# Altium project Serializer_Board.PrjPcb (part 1 of 2)
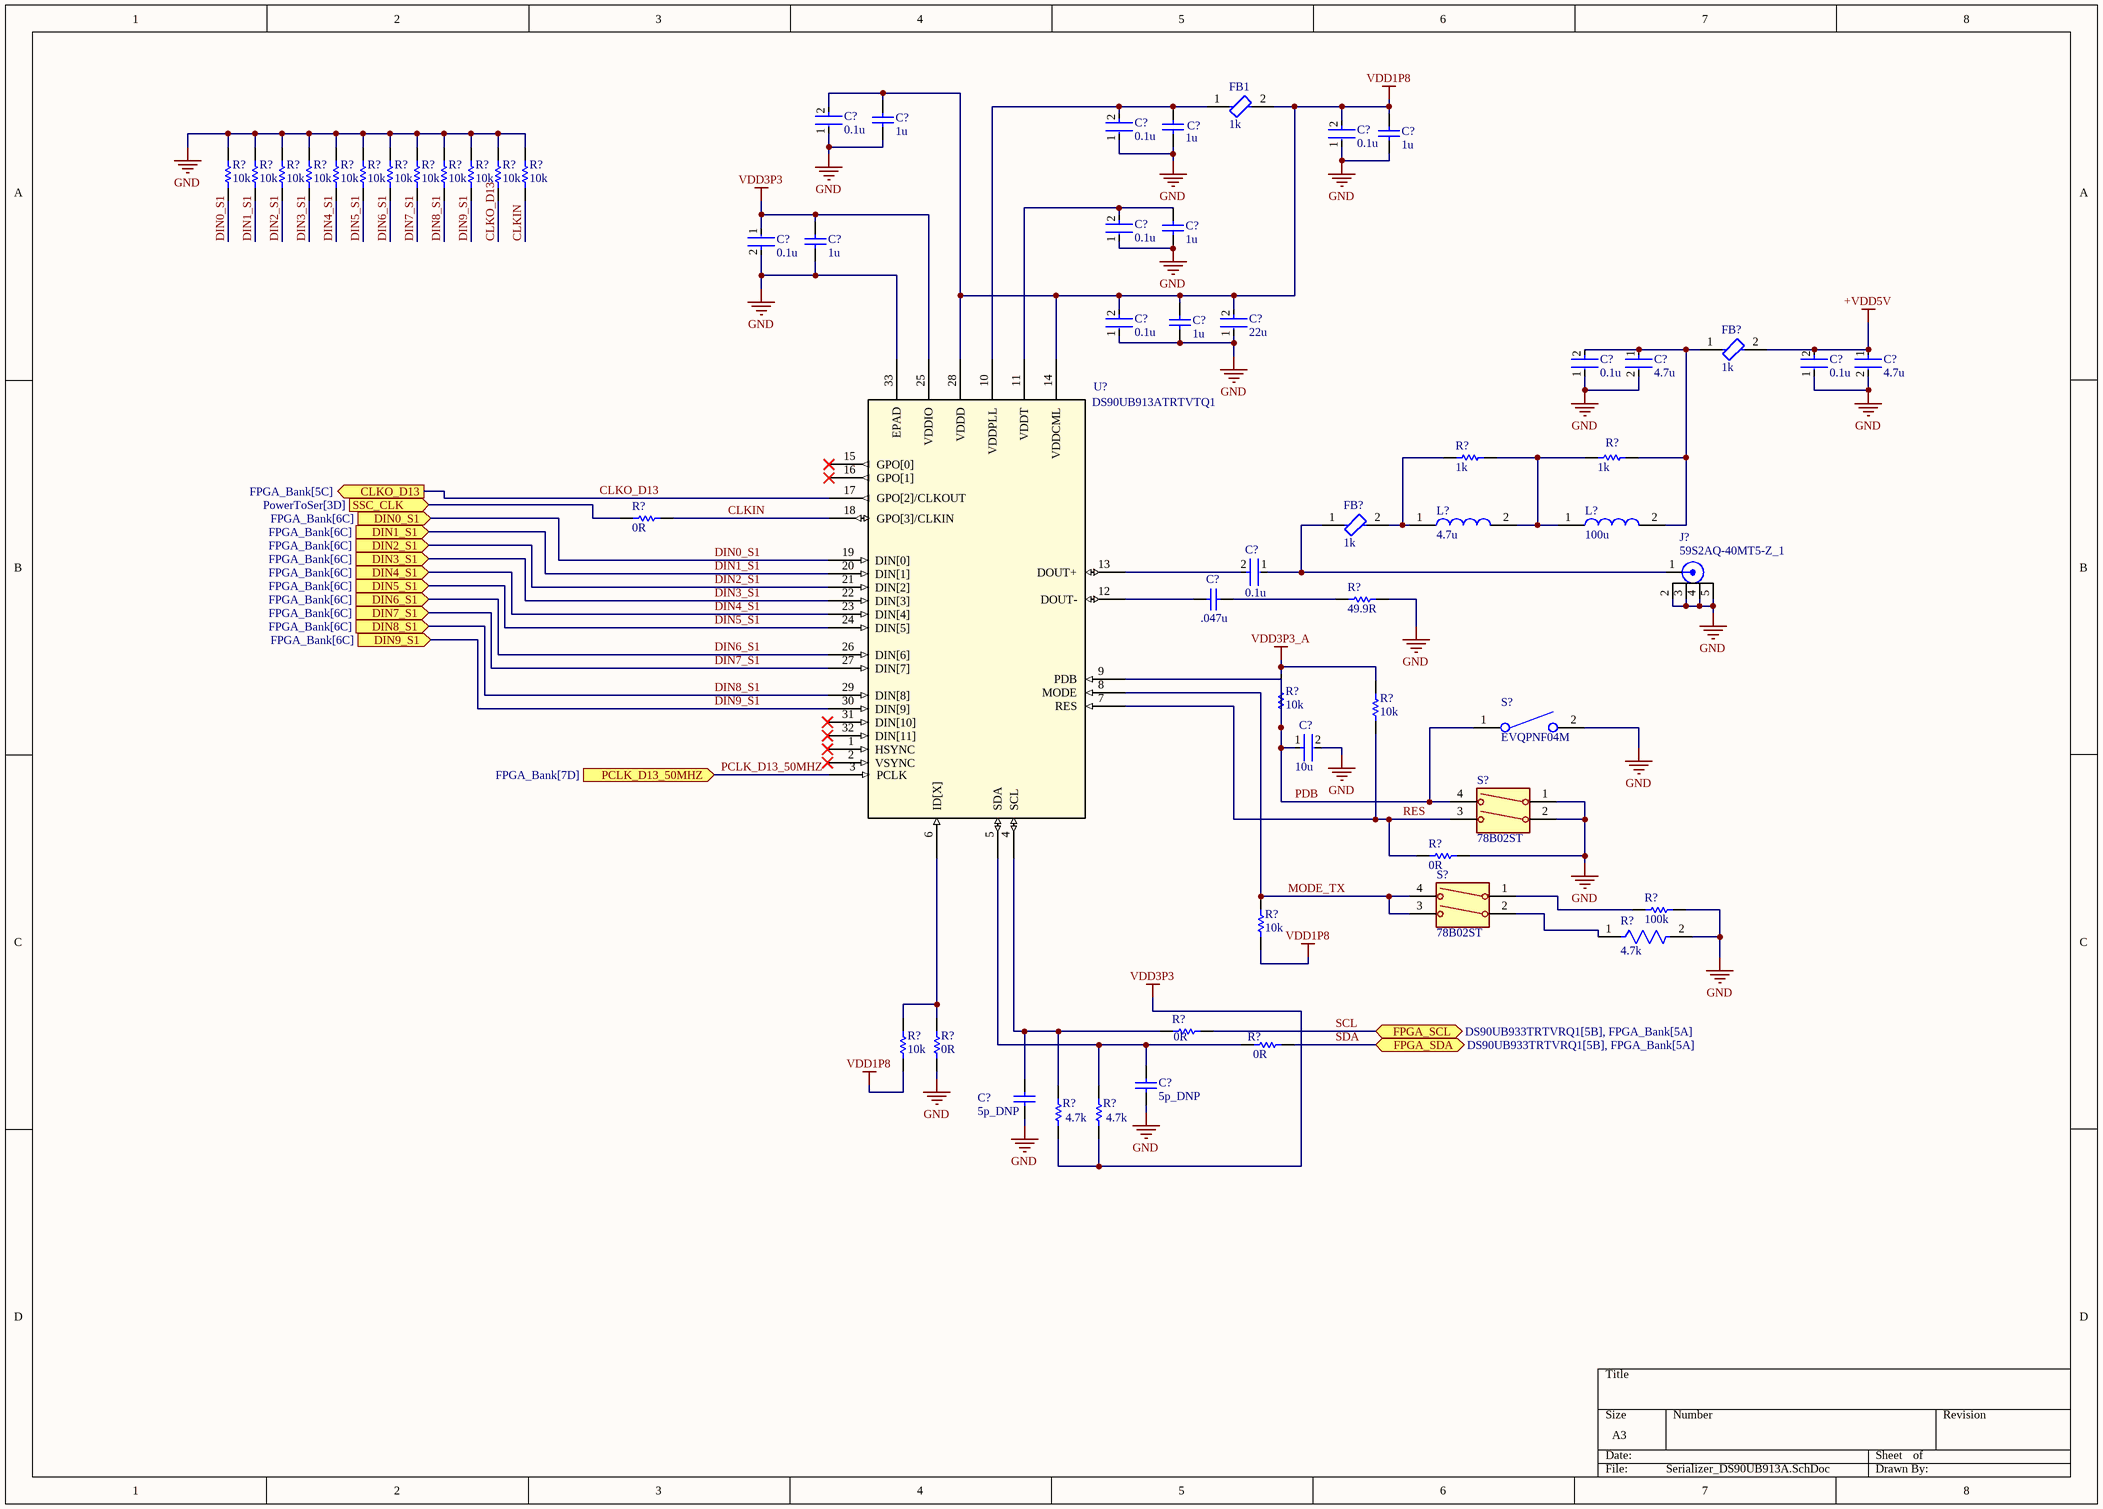
[diagram p0: Serializer_DS90UB913A.SchDoc]
5 sheets, 223 parts. Net scope: flat (ports and power ports of the same name join across sheets).
Sheets:
  Serializer_DS90UB913A.SchDoc
  BuckRegulatorOnSer.SchDoc
  DS90UB933TRTVRQ1.SchDoc
  FTDI_USB_To_UART.SchDoc
  FPGA_Bank.SchDoc

## Sheet Serializer_DS90UB913A.SchDoc
size A3; SheetNumber: 2; SheetTotal: 7

### Parts
(Parts that share a designator on the sheet are numbered #1, #2 ... from top to bottom, then left to right.)
C?#1  0.1u  [FP-GRM15-MFG]
C?#2  0.1u  [FP-GRM15-MFG]
C?#3  0.1u  [FP-GRM15-MFG]
C?#4  1u  [CAPC1608X90X35ML10T15]
C?#5  1u  [CAPC1608X90X35ML10T15]
C?#6  1u  [CAPC1608X90X35ML10T15]
C?#7  0.1u  [FP-GRM15-MFG]
C?#8  1u  [CAPC1608X90X35ML10T15]
C?#9  1u  [CAPC1608X90X35ML10T15]
C?#10  0.1u  [FP-GRM15-MFG]
C?#11  0.1u  [FP-GRM15-MFG]
C?#12  22u  [FP-GCM32E-0_3-IPC_B]
C?#13  1u  [CAPC1608X90X35ML10T15]
C?#14  0.1u  [FP-GRM15-MFG]
C?#15  4.7u  [FP-GRM21B-0_15-MFG]
C?#16  0.1u  [FP-GRM15-MFG]
C?#17  4.7u  [FP-GRM21B-0_15-MFG]
C?#18  0.1u  [FP-GRM15-MFG]
C?#19  .047u  [CAPC1608X90X35ML10T15]
C?#20  10u  [FP-GRM21B-0_1-IPC_C]
C?#21  5p_DNP  [CAPC1005X55X25LL05T10]
C?#22  5p_DNP  [CAPC1005X55X25LL05T10]
FB1  1k  [FP-BLM18-0_15-t0_8-MFG]
FB?#1  1k  [FP-BLM18-0_15-t0_8-MFG]
FB?#2  1k  [FP-BLM18-0_15-t0_8-MFG]
J?#1  59S2AQ-40MT5-Z_1  [ROSENBERGER_59S2AQ-40MT5-Z_1]
L?#1  4.7u  [1008PS]
L?#2  100u  [MSS7341T104MLB]
R?#1  10k  [RESC1005X40X25ML05T05]
R?#2  10k  [RESC1005X40X25ML05T05]
R?#3  10k  [RESC1005X40X25ML05T05]
R?#4  10k  [RESC1005X40X25ML05T05]
R?#5  10k  [RESC1005X40X25ML05T05]
R?#6  10k  [RESC1005X40X25ML05T05]
R?#7  10k  [RESC1005X40X25ML05T05]
R?#8  10k  [RESC1005X40X25ML05T05]
R?#9  10k  [RESC1005X40X25ML05T05]
R?#10  10k  [RESC1005X40X25ML05T05]
R?#11  10k  [RESC1005X40X25ML05T05]
R?#12  10k  [RESC1005X40X25ML05T05]
R?#13  1k  [RESC1608X55X30LL15T15]
R?#14  1k  [RESC1608X55X30LL15T15]
R?#15  0R  [RESC1005X40X25LL05T05]
R?#16  49.9R  [RESC1608X55X30ML15T15]
R?#17  10k  [RESC1005X40X25ML05T05]
R?#18  10k  [RESC1005X40X25ML05T05]
R?#19  0R  [RESC1005X40X25LL05T05]
R?#20  100k  [RESC2013X70X40ML20T20]
R?#21  10k  [RESC1005X40X25ML05T05]
R?#22  4.7k  [FP-ERJ6GE-MFG]
R?#23  0R  [RESC1005X40X25LL05T05]
R?#24  0R  [RESC1005X40X25LL05T05]
R?#25  10k  [RESC1005X40X25ML05T05]
R?#26  0R  [RESC1005X40X25LL05T05]
R?#27  4.7k  [RESC1005X40X25LL05T05]
R?#28  4.7k  [RESC1005X40X25LL05T05]
S?#1  EVQPNF04M  [EVQ5PN05K]
S?#2  78B02ST  [78B02ST]
S?#3  78B02ST  [78B02ST]
U?#1  DS90UB913ATRTVTQ1  [RTV32_3P1X3P1_TEX]

### Ports
CLKO_D13 (out, see FPGA_Bank[5C]), DIN0_S1 (in, see FPGA_Bank[6C]), DIN1_S1 (in, see FPGA_Bank[6C]), DIN2_S1 (in, see FPGA_Bank[6C]), DIN3_S1 (in, see FPGA_Bank[6C]), DIN4_S1 (in, see FPGA_Bank[6C]), DIN5_S1 (in, see FPGA_Bank[6C]), DIN6_S1 (in, see FPGA_Bank[6C]), DIN7_S1 (in, see FPGA_Bank[6C]), DIN8_S1 (in, see FPGA_Bank[6C]), DIN9_S1 (in, see FPGA_Bank[6C]), FPGA_SCL (bidir, see DS90UB933TRTVRQ1[5B], FPGA_Bank[5A]), FPGA_SDA (bidir, see DS90UB933TRTVRQ1[5B], FPGA_Bank[5A]), PCLK_D13_50MHZ (in, see FPGA_Bank[7D]), SSC_CLK (in, see PowerToSer[3D])

### Nets
+VDD5V: C?#16.2 C?#17.1 FB?#1.2
GND: C?#1.1 C?#2.1 C?#3.1 C?#4.1 C?#5.1 C?#6.1 C?#7.1 C?#8.1 C?#9.1 C?#10.2 C?#11.1 C?#12.1 C?#13.1 C?#14.1 C?#15.2 C?#16.1 C?#17.2 C?#20.2 C?#21.1 C?#22.1 J?#1.2 J?#1.3 J?#1.4 J?#1.5 R?#1.2 R?#2.2 R?#3.2 R?#4.2 R?#5.2 R?#6.2 R?#7.2 R?#8.2 R?#9.2 R?#10.2 R?#11.2 R?#12.2 R?#16.2 R?#19.1 R?#20.2 R?#22.2 R?#26.1 S?#1.2(NO) S?#2.1(COM_1) S?#2.2(NO_1) U?#1.33(EPAD)
VDD1P8: C?#1.2 C?#3.2 C?#4.2 C?#6.2 C?#11.2 C?#12.2 C?#13.2 FB1.2 R?#21.1 R?#25.1 U?#1.14(VDDCML) U?#1.28(VDDD)
VDD3P3: C?#9.2 C?#10.1 R?#27.1 R?#28.1 U?#1.25(VDDIO)
VDD3P3_A: R?#17.2 R?#18.2
CLKIN: R?#12.1 R?#15.1 U?#1.18(GPO[3]/CLKIN)  [project net CLKIN_2]
CLKO_D13: R?#11.1 U?#1.17(GPO[2]/CLKOUT) ; port CLKO_D13
DIN0_S1: R?#1.1 U?#1.19(DIN[0]) ; port DIN0_S1
DIN1_S1: R?#2.1 U?#1.20(DIN[1]) ; port DIN1_S1
DIN2_S1: R?#3.1 U?#1.21(DIN[2]) ; port DIN2_S1
DIN3_S1: R?#4.1 U?#1.22(DIN[3]) ; port DIN3_S1
DIN4_S1: R?#5.1 U?#1.23(DIN[4]) ; port DIN4_S1
DIN5_S1: R?#6.1 U?#1.24(DIN[5]) ; port DIN5_S1
DIN6_S1: R?#7.1 U?#1.26(DIN[6]) ; port DIN6_S1
DIN7_S1: R?#8.1 U?#1.27(DIN[7]) ; port DIN7_S1
DIN8_S1: R?#9.1 U?#1.29(DIN[8]) ; port DIN8_S1
DIN9_S1: R?#10.1 U?#1.30(DIN[9]) ; port DIN9_S1
MODE_TX: R?#21.2 S?#3.3(COM_2) S?#3.4(NO_2) U?#1.8(MODE)  [project net MODE_TX_2]
PCLK_D13_50MHZ: U?#1.3(PCLK) ; port PCLK_D13_50MHZ
PDB: C?#20.1 R?#17.1 S?#1.1(COM) S?#2.4(NO_2) U?#1.9(PDB)  [project net PDB_2]
RES: R?#18.1 R?#19.2 S?#2.3(COM_2) U?#1.7(RES)  [project net RES_2]
SCL: R?#23.1 ; port FPGA_SCL
SDA: R?#24.1 ; port FPGA_SDA
NetC?#2_2: C?#2.2 C?#5.2 FB1.1 U?#1.10(VDDPLL)
NetC?#7_2: C?#7.2 C?#8.2 U?#1.11(VDDT)
NetC?#14_2: C?#14.2 C?#15.1 FB?#1.1 L?#2.2 R?#14.2
NetC?#18_1: C?#18.1 FB?#2.1 J?#1.1
NetC?#18_2: C?#18.2 U?#1.13(DOUT+)
NetC?#19_1: C?#19.1 U?#1.12(DOUT-)
NetC?#19_2: C?#19.2 R?#16.1
NetC?#21_2: C?#21.2 R?#24.2 R?#28.2 U?#1.5(SDA)
NetC?#22_2: C?#22.2 R?#23.2 R?#27.2 U?#1.4(SCL)
NetFB?#2_2: FB?#2.2 L?#1.1 R?#13.1
NetL?#1_2: L?#1.2 L?#2.1 R?#13.2 R?#14.1
NetR?#15_2: R?#15.2 ; port SSC_CLK
NetR?#20_1: R?#20.1 S?#3.1(COM_1)
NetR?#22_1: R?#22.1 S?#3.2(NO_1)
NetR?#25_2: R?#25.2 R?#26.2 U?#1.6(ID[X])

Not connected (* = marked no-connect by the designer): U?#1 1(HSYNC)* 2(VSYNC)* 15(GPO[0])* 16(GPO[1])* 31(DIN[10])* 32(DIN[11])*

### Library data of the parts
C?#1-C?#3 C?#7 C?#10 C?#11 C?#14 C?#16 C?#18 = CMP-2100-03641-2: CAP CER 0.1UF 16V X7R 0402; Manufacturer Part Number: GRM155R71C104KA88D; Manufacturer: Murata; Standoff Height: 0mm; Tolerance: 10%; Voltage Rating: 16Vdc; Material: Ceramic; Capacitance: 0.10μF; Value: 0.10μF; RoHS: TRUE; Temperature Characteristic: X7R; Octopart: https://octopart.com/grm155r71c104ka88d-murata-196880; Digikey Description: CAP CER 0.1UF 16V X7R 0402; Device Class L3: Ceramic Capacitors; Height: 0.55mm; ComponentLink2Description: Datasheet; Temperature Range Low: -55°C; Ipc Land Pattern Name: CAPC10050X219; ComponentLink2URL: https://search.murata.co.jp/Ceramy/image/img/A01X/G101/ENG/GRM155R71H471KA01-01A.pdf; Device Class L1: Passive Components; Lead Free: yes; Category: Cap; Package: GRM15; Temperature: -55°C to +125°C; Device Class L2: Capacitors; Temperature Range High: +125°C; Mouser Description: 0402 0.1 uF 16V ±10 % Tolerance X7R SMT Multilayer Ceramic Capacitor
C?#4-C?#6 C?#8 C?#9 C?#13 = CMP-2006-02460-1: Manufacturer: Murata; Part Number: GRM188R71E105KA12D
C?#12 = CMP-06035-049658-1: Ceramic Capacitor for Automotive 22uF ±10% 16VDC X7R 1210 Embossed T/R; Voltage Rating: 16V; Max Operating Temperature: 125°C; Case/Package: 1210; Packaging: Tape and Reel; Termination: SMD/SMT; Height: 2.5mm; Voltage Rating (DC): 16V; Length: 3.2mm; Width: 0.098inch; Voltage: 16V; Depth: 2.5mm; Package Quantity: 1; Mount: Surface Mount; Min Operating Temperature: -55°C; Case Code (Metric): 3225; Case Code (Imperial): 1210; Radiation Hardening: No; Thickness: 0.106inch; Ratings: AEC-Q200; Capacitance: 22uF; Tolerance: 10%; Dielectric: X7R; Lead Free: Lead Free
C?#15 C?#17 = CMP-2007-03401-2: CAP CER 4.7UF 16V X7R 0805; Material: Ceramic; Tolerance: 10%; Case Code (Metric): 2012; Voltage Rating: 16V; RoHS Compliant: Yes; Voltage Rating (DC): 16V; Case/Package: 0805; Number of Pins: 2; Thickness: 0.053inch; Voltage: 16V; Mount: Surface Mount; Packaging: Tape and Reel; Lead Free: Lead Free; Case Code (Imperial): 0805; Series: GRM; Width: 0.049inch; Package Quantity: 1; Construction: Flat; Min Operating Temperature: -55°C; Termination: SMD/SMT; Max Operating Temperature: 125°C; Length: 2mm; Dielectric: X7R; Depth: 1.25mm; REACH SVHC: No SVHC; Height: 1.25mm; Capacitance: 4.7uF
C?#19 = CMP-2006-02927-1: Manufacturer: Murata; Part Number: GRM188R71H473KA61D
C?#20 = CMP-2007-03453-2: Chip Multilayer Ceramic Capacitors for General Purpose, 0805, 10uF, X5R, 15%, 10%, 16V; Radiation Hardening: No; Thickness: 0.053inch; Voltage Rating (DC): 16V; Lead Free: Lead Free; Package Quantity: 1; Width: 1.25mm; Case Code (Imperial): 0805; Depth: 1.25mm; Packaging: Tape and Reel; Dielectric: X5R; Max Operating Temperature: 85°C; Tolerance: 10%; Voltage Rating: 16V; Voltage: 16V; Capacitance: 10uF; Height: 1.25mm; Case Code (Metric): 2012; Material: Ceramic; Mount: Surface Mount; Case/Package: 0805; REACH SVHC: No SVHC; Length: 2mm; Min Operating Temperature: -55°C; Termination: SMD/SMT
C?#21 C?#22 = CMP-2008-04391-1: Manufacturer: Murata; Part Number: GRM1555C1H5R0CA01D
FB1 FB?#1 FB?#2 = CMP-0686-00457-3: Chip Ferrite Bead, 0603, 1000Ω @ 100MHz, 0.5Ω, 25%, 450mABLM18AG102SN1D; Number of Circuits: 1; Max DC Current: 400mA; Shielding: Unshielded; DC Resistance (DCR): 500mR; Material: Steel; DC Resistance-Max: 700mR; Impedance: 1kR; Case Code (Imperial): 0603; Max Current Rating: 400mA; Frequency: 100MHz; Min Operating Temperature: -55°C; Case/Package: 0603; Depth: 0.8mm; Lead Free: Lead Free; Core Material: Ferrite; Current Rating: 400mA; Resistance: 500mR; Case Code (Metric): 1608; DC Current: 400mA; Package Quantity: 1; Packaging: Tape and Reel; Width: 0.8mm; Military Standard: Not; Height: 0.8mm; Series: BLM18A; Max Operating Temperature: 125°C; Tolerance: 25%; Termination: SMD/SMT; Test Frequency: 100MHz; Number of Lines: 1; Number of Pins: 2; REACH SVHC: No SVHC; Length: 1.6mm; Radiation Hardening: No
J?#1 = 59S2AQ-40MT5-Z_1: RF Connectors / Coaxial Connectors Plug PC-Board SMD Right AngleZWatrBlue; Package: None; Price: None; Value: *; MP: 59S2AQ-40MT5-Z_1; Availability: Unavailable
L?#1 = 1008PS-472KLB: Inductor; Manufacturer_Name: COILCRAFT; Datasheet Link: https://www.coilcraft.com/pdfs/1008ps.pdf; Manufacturer_Part_Number: 1008PS-472KLB; Mouser Part Number: 994-1008PS-472KLB; Mouser Price/Stock: https://www.mouser.co.uk/ProductDetail/Coilcraft/1008PS-472KLB?qs=zCSbvcPd3pZjtFGTYwqcAw%3D%3D
L?#2 = MSS7341T-104MLB: Inductor; Manufacturer_Name: COILCRAFT; Manufacturer_Part_Number: MSS7341T-104MLD; Datasheet Link: https://componentsearchengine.com/Datasheets/2/MSS7341T-104MLD.pdf; Height: 4.1mm; Mouser Part Number: 994-MSS7341T-104MLD; Mouser Price/Stock: https://www.mouser.co.uk/ProductDetail/Coilcraft/MSS7341T-104MLD?qs=zCSbvcPd3paCy6uSM7W%2FOg%3D%3D
R?#1-R?#12 R?#17 R?#18 R?#21 R?#25 = CMP-2002-00433-1: Part Number: ERJ-2GEJ103X; Manufacturer: Panasonic
R?#13 R?#14 = CMP-2000-00180-1: Part Number: ERJ-3EKF1001V; Manufacturer: Panasonic
R?#15 R?#19 R?#23 R?#24 R?#26 = CMP-2000-07451-1: Chip Resistor, 0 Ohm, 0.1 W, -55 to 155 degC, 0402 (1005 Metric), RoHS, Tape and Reel; Manufacturer: Panasonic; Voltage Rating (DC): 50V; Temperature Coefficient: 600ppm/��C; Max Power Dissipation: 100mW; Resistance: 0mOhm; Tolerance: 5%; Number of Terminations: 2; Mount: SurfaceMount; Height: 0.35mm; Packaging: TapeandReel; Contact Plating: Tin; Manufacturer URL: http://www.panasonic.com/; Composition: ThickFilm; Max Operating Temperature: 155degC; REACH SVHC: NoSVHC; Case/Package: 0402; Package Reference: 402; Depth: 0.5mm; Package Description: 2-Pin Surface Mount Device, Body 1 x 0.5 mm; Datasheet URL: https://industrial.panasonic.com/cdbs/www-data/pdf/RDA0000/AOA0000C301.pdf; RoHSCompliant: True; Case Code (Imperial): 0402; Military Standard: Not; Min Operating Temperature: -55degC; Power Rating: 100mW; Datasheet Version: 03/2015; Length: 1mm; Case Code (Metric): 1005; Termination: SMD/SMT; Mounting Technology: SurfaceMount; Voltage Rating: 50V; Width: 0.02inch; Package Quantity: 1; Lead Free: LeadFree; Radiation Hardening: No
R?#16 = CMP-2000-00538-1: Manufacturer: Panasonic; Part Number: ERJ-3EKF49R9V
R?#20 = CMP-2001-04377-1: Part Number: ERJ-6ENF1003V; Manufacturer: Panasonic
R?#22 = CMP-2001-00420-2: RES SMD 4.7K OHM 5% 1/8W 0805; Power Rating: 125mW; Voltage Rating (DC): 150V; Temperature Coefficient: 200ppm/°C; Resistance: 4.7kR; Lead Free: Lead Free; Length: 2mm; Resistance Tolerance: 5%; Tolerance: 5%; Mount: Surface Mount; Number of Terminations: 2; Technology: THICK FILM; Case Code (Metric): 2012; Resistor Type: Thick Film; Max Power Dissipation: 125mW; Series: ERJ; Radiation Hardening: No; Min Operating Temperature: -55°C; RoHS Compliant: Yes; Case/Package: 0805; Package Quantity: 5000; Size Code: 0805; Width: 0.049inch; Voltage Rating: 150V; Contact Plating: Tin; Military Standard: Not; Height: 0.6mm; Construction: Rectangular; Packaging: Tape and Reel; Max Operating Temperature: 155°C; Termination: SMD/SMT; REACH SVHC: No SVHC; Case Code (Imperial): 0805; Depth: 1.25mm
R?#27 R?#28 = CMP-2002-01154-4: Chip Resistor, 4.7 KOhm, +/- 1%, 0.1 W, -55 to 155 degC, 0402 (1005 Metric), RoHS, Tape and Reel; PartNumber: ERJ-2RKF4701X; Voltage Rating: 50 V; Case\/Package: 0402; Power Rating: 100 mW; Height: 0.35 mm; Mounting Technology: Surface Mount; REACH SVHC: Yes; Resistance: 4.7 KOhm; Max Operating Temperature: 155 degC; ComponentLink1Description: Manufacturer URL; ComponentLink2Description: Datasheet; Pins: 2; PackageReference: 0402; Tolerance: 1%; Case Code (Imperial): 0402; Length: 1 mm; PackageDescription: 2-Pin Surface Mount Device, Body 1 x 0.5 mm; RoHSCompliant: true; Package Quantity: 1; Radiation Hardening: No; DatasheetVersion: 04/2015; Width: 0.5 mm; Case Code (Metric): 1005; Mount: Surface Mount; ComponentLink1URL: http://www.panasonic.com/; Min Operating Temperature: -55 degC; Packaging: Cut Tape; ComponentLink2URL: http://industrial.panasonic.com/cdbs/www-data/pdf/RDA0000/AOA0000C86.pdf
S?#1 = EVQPNF04M: Switch; Manufacturer_Name: Panasonic; Datasheet Link: https://industrial.panasonic.com/cdbs/www-data/pdf/ATK0000/ATK0000C376.pdf; Manufacturer_Part_Number: EVQPNF04M
S?#2 S?#3 = 78B02ST: PCB Slide Switch Single Pole Single Throw (SPST) 150 mA Slide; Manufacturer_Name: Grayhill; Geometry.Height: 7.49mm; Mouser Part Number: 706-78B02ST; Mouser Price/Stock: https://www.mouser.co.uk/ProductDetail/Grayhill/78B02ST?qs=ls7QRyWmRk63wsT9ZvgLUg%3D%3D; Manufacturer_Part_Number: 78B02ST; Datasheet Link: https://datasheet.datasheetarchive.com/originals/distributors/SFDatasheet-7/sf-000148477.pdf
U?#1 = DS90UB913ATRTVTQ1: 25- to 100-MHz, 10-bit & 12-bit FPD-Link III serializer 32-WQFN -40 to 105; Manufacturer_Name: Texas Instruments; Copyright: Copyright (C) 2025 Ultra Librarian. All rights reserved.; Manufacturer_Part_Number: DS90UB913ATRTVTQ1; RefDes: RefDes; Type: Type

## Sheet BuckRegulatorOnSer.SchDoc
size 381 x 241 mm; SheetNumber: 3; SheetTotal: 7
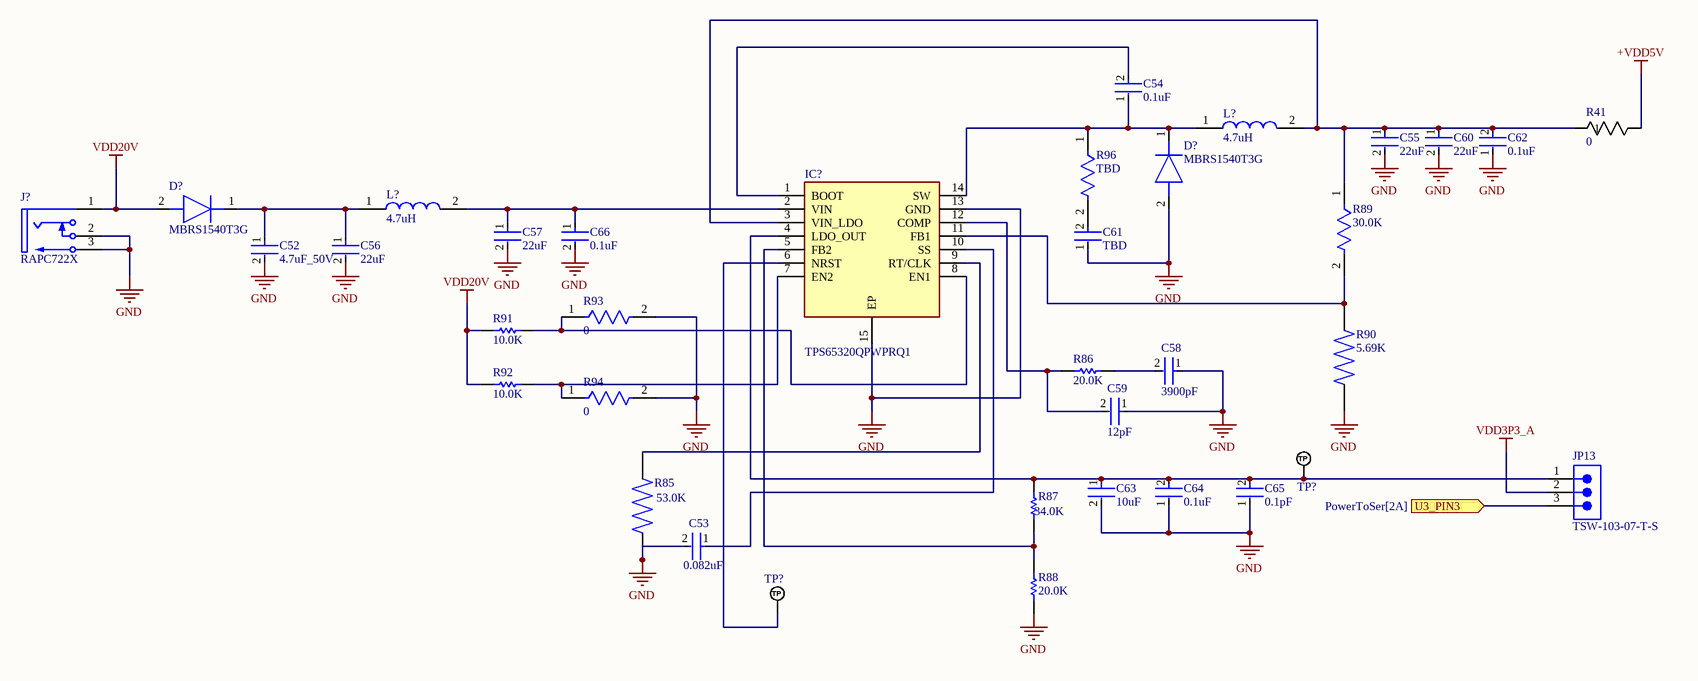
[diagram p1: BuckRegulatorOnSer.SchDoc]

### Parts
(Parts that share a designator on the sheet are numbered #1, #2 ... from top to bottom, then left to right.)
C52  4.7uF_50V  [FP-C3216-160-0_2-IPC_B]
C53  0.082uF  [FP-C0402-BB-MFG]
C54  0.1uF  [FP-GRM15-MFG]
C55  22uF  [FP-C3216-160-0_2-IPC_B]
C56  22uF  [FP-C3216-160-0_2-IPC_B]
C57  22uF  [FP-C3216-160-0_2-IPC_B]
C58  3900pF  [FP-C0402-BB-MFG]
C59  12pF  [FP-C0402-BB-MFG]
C60  22uF  [FP-C3216-160-0_2-IPC_B]
C61  TBD  [FP-GRM15-MFG]
C62  0.1uF  [FP-GRM15-MFG]
C63  10uF  [FP-C2012-125-0_2-MFG]
C64  0.1uF  [FP-GRM15-MFG]
C65  0.1pF  [FP-GRM15-MFG]
C66  0.1uF  [FP-GRM188-0_1-e0_2_0_5-IPC_B]
D?#1  MBRS1540T3G  [DIOM5436X256N]
D?#2  MBRS1540T3G  [DIOM5436X256N]
IC?#1  TPS65320QPWPRQ1  [SOP65P640X120-15N]
J?#2  RAPC722X  [SWITCH-RAPC712X-3_V]
JP13  TSW-103-07-T-S  [SMTC-TSW-103-07-X-S]
L?#3  4.7uH  [XFL4020472MEB]
L?#4  4.7uH  [XFL4020472MEB]
R41  0  [RC2512N_VIS]
R85  53.0K  [RESC1608X46N]
R86  20.0K  [RESC1608X55X30ML15T15]
R87  34.0K  [RESC1608X55X30ML15T15]
R88  20.0K  [RESC1608X55X30ML15T15]
R89  30.0K  [FP-ERJ3EK-IPC_A]
R90  5.69K  [RESC1608X46N]
R91  10.0K  [RESC1609X55X30LL15T15]
R92  10.0K  [RESC1609X55X30LL15T15]
R93  0  [FP-ERJ-3GEY0R00V-MFG]
R94  0  [FP-ERJ-3GEY0R00V-MFG]
R96  TBD  [FP-CRCW0603-e3-MFG]
TP?#1  TP_NOBOM  [PAD_RND_1MM]  (value not drawn)  (no BOM)
TP?#2  TP_NOBOM  [PAD_RND_1MM]  (value not drawn)  (no BOM)

### Ports
U3_PIN3 (in, see PowerToSer[2A])

### Nets
+VDD5V: R41.2
GND: C52.2 C53.2 C55.2 C56.2 C57.2 C58.1 C59.1 C60.2 C61.1 C62.1 C63.2 C64.1 C65.1 C66.2 D?#1.2(A) IC?#1.13(GND) IC?#1.15(EP) J?#2.2 J?#2.3 R85.2 R88.2 R90.2 R93.2 R94.2
VDD3P3_A: JP13.2
VDD20V: D?#2.2(A) J?#2.1 R91.1 R92.1
NetC52_1: C52.1 C56.1 D?#2.1(K) L?#4.1
NetC53_1: C53.1 IC?#1.10(SS)
NetC54_1: C54.1 D?#1.1(K) IC?#1.14(SW) L?#3.1 R96.1
NetC54_2: C54.2 IC?#1.1(BOOT)
NetC55_1: C55.1 C60.1 C62.2 IC?#1.3(VIN_LDO) L?#3.2 R41.1 R89.1
NetC57_1: C57.1 C66.1 IC?#1.2(VIN) L?#4.2
NetC58_2: C58.2 R86.2
NetC59_2: C59.2 IC?#1.12(COMP) R86.1
NetC61_2: C61.2 R96.2
NetC63_1: C63.1 C64.2 C65.2 IC?#1.4(LDO_OUT) JP13.1 R87.1 TP?#1.1(TP)
NetIC?#1_5: IC?#1.5(FB2) R87.2 R88.1
NetIC?#1_6: IC?#1.6(NRST) TP?#2.1(TP)
NetIC?#1_7: IC?#1.7(EN2) R92.2 R94.1
NetIC?#1_8: IC?#1.8(EN1) R91.2 R93.1
NetIC?#1_9: IC?#1.9(RT/CLK) R85.1
NetIC?#1_11: IC?#1.11(FB1) R89.2 R90.1
NetJP13_3: JP13.3 ; port U3_PIN3

### Library data of the parts
C52 = CMP-08246-002892-1: Multilayer Ceramic Capacitors 4.7uF ±20% 50V X7R SMD 1206; Depth: 1.6mm; Radiation Hardening: No; Length: 3.2mm; Dielectric: X7R; RoHS Compliant: Yes; Packaging: Tape and Reel; Voltage Rating: 50V; Voltage Rating (DC): 50V; Min Operating Temperature: -55°C; Resistor Type: Ceramic; Lead Free: Lead Free; Case/Package: 1206; Dielectric Material: Ceramic; Max Operating Temperature: 125°C; Series: C; Width: 0.063inch; Height: 1.6mm; Weight: 0.000571oz; Thickness: 1.6mm; Capacitance: 4.7uF; Case Code (Imperial): 1206; Tolerance: 20%; Construction: Flat; Case Code (Metric): 3216; Termination: SMD/SMT; Mount: Surface Mount; Package Quantity: 1
C53 = CMP-1034-02057-3: Multilayer Ceramic Capacitor, C Series, 0.082 - F, - 10%, X7r, 16 V, 0402 [1005 Metric] Rohs Compliant: Yes; Manufacturer: Kemet; Manufacturer Part Number: C0402C823K4RACTU; Capacitance: 82,000 pF; Voltage Rating: 16 V; Temperature Coefficient: 15%; Value: 82,000 pF; Tolerance: 0.1; Device Class L2: Capacitors; ComponentLink2Description: Datasheet; Category: Cap; Temperature Range High: +125°C; Height: 0.55mm; Lead Free: Yes; Octopart: https://octopart.com/c0402c823k4ractu-kemet-134782; Device Class L3: Ceramic Capacitors; Ipc Land Pattern Name: CAPC10050X50; Package: C0402-BB; Temperature Range Low: -55°C; Temperature: -55°C to +125°C; Mouser Description: Multilayer Ceramic Capacitors MLCC - SMD/SMT 16volts 82000pF X7R 10%; Material: Ceramic; ComponentLink2URL: https://content.kemet.com/datasheets/KEM_C1002_X7R_SMD.pdf; Device Class L1: Passive Components; RoHS: TRUE; Automotive: No; Temperature Characteristic: X7R; Digikey Description: Multilayer Ceramic Capacitor, C Series, 0.082 - F, - 10%, X7r, 16 V, 0402 [1005 Metric] Rohs Compliant: Yes
C54 C61 C62 C64 C65 = CMP-2100-03641-2: as C?#1 on sheet Serializer_DS90UB913A; RoHS: TRUE; Temperature Characteristic: X7R; Octopart: https://octopart.com/grm155r71c104ka88d-murata-196880; Digikey Description: CAP CER 0.1UF 16V X7R 0402; Device Class L3: Ceramic Capacitors; Height: 0.55mm; ComponentLink2Description: Datasheet; Temperature Range Low: -55°C; Ipc Land Pattern Name: CAPC10050X219; ComponentLink2URL: https://search.murata.co.jp/Ceramy/image/img/A01X/G101/ENG/GRM155R71H471KA01-01A.pdf; Device Class L1: Passive Components; Lead Free: yes; Category: Cap; Package: GRM15; Temperature: -55°C to +125°C; Device Class L2: Capacitors; Temperature Range High: +125°C; Mouser Description: 0402 0.1 uF 16V ±10 % Tolerance X7R SMT Multilayer Ceramic Capacitor
C55-C57 C60 = CMP-08246-004697-1: Multilayer Ceramic Capacitors 22uF ±20% 25V X5R SMD 1206; RoHS Compliant: Yes; Thickness: 0.071inch; Mount: Surface Mount; Termination: SMD/SMT; Height: 1.6mm; Resistor Type: Ceramic; REACH SVHC: No SVHC; Packaging: Tape and Reel; Construction: Flat; Depth: 1.6mm; Lead Free: Lead Free; Tolerance: 20%; Width: 0.063inch; Capacitance: 22uF; Weight: 0.000571oz; Case Code (Imperial): 1206; Case/Package: 1206; Min Operating Temperature: -55°C; Package Quantity: 1; Voltage Rating (DC): 25V; Length: 3.2mm; Voltage Rating: 25V; Case Code (Metric): 3216; Dielectric: X5R; Series: C; Dielectric Material: Ceramic; Max Operating Temperature: 85°C
C58 = CMP-1034-01791-3: CAP CER 3900PF 16V X7R 0402; Manufacturer Part Number: C0402C392K4RACTU; Manufacturer: Kemet; Value: 3,900 pF; Temperature Coefficient: 15%; Tolerance: 0.1; Material: Ceramic; Temperature Range High: +125°C; Automotive: No; Octopart: https://octopart.com/c0402c392k4ractu-kemet-12577363; RoHS: TRUE; Category: Cap; Temperature Range Low: -55°C; Device Class L1: Passive Components; Digikey Description: CAP CER 3900PF 16V X7R 0402; ComponentLink2Description: Datasheet; Voltage Rating: 16 V; Device Class L2: Capacitors; ComponentLink2URL: https://content.kemet.com/datasheets/KEM_C1002_X7R_SMD.pdf; Package: C0402-BB; Lead Free: Yes; Ipc Land Pattern Name: CAPC10050X50; Mouser Description: Multilayer Ceramic Capacitors MLCC - SMD/SMT 16volts 3900pF X7R 10%; Temperature Characteristic: X7R; Height: 0.55mm; Temperature: -55°C to +125°C; Device Class L3: Ceramic Capacitors; Capacitance: 3,900 pF
C59 = CMP-2008-03330-2: CAP CER 12PF 25V C0G/NP0 0402; Manufacturer Part Number: C0402C120J3GACAUTO; Manufacturer: Kemet; Material: Ceramic; Temperature Characteristic: C0G; Temperature Coefficient: 15%; Tolerance: 0.05; Temperature Range High: +125°C; ComponentLink2URL: https://content.kemet.com/datasheets/KEM_C1002_X7R_SMD.pdf; Lead Free: Yes; Device Class L2: Capacitors; Voltage Rating: 25 V; Device Class L1: Passive Components; Temperature Range Low: -55°C; Value: 12 pF; Automotive: No; Category: Cap; Height: 0.55mm; Octopart: https://octopart.com/c0402c120j3gacauto-kemet-21768529; Digikey Description: CAP CER 12PF 25V C0G/NP0 0402; Temperature: -55°C to +125°C; Device Class L3: Ceramic Capacitors; Package: C0402-BB; Capacitance: 12 pF; ComponentLink2Description: Datasheet; Ipc Land Pattern Name: CAPC10050X50; RoHS: TRUE
C63 = CMP-2000-05452-2: Multilayer Ceramic Capacitors 10μF ±10% 10V X7R SMD 0805; Series: C; Case/Package: 0805; REACH SVHC: No SVHC; Tolerance: 10%; Resistor Type: Ceramic; Termination: SMD/SMT; Weight: 0.000194oz; Depth: 1.25mm; Capacitance: 10uF; Construction: Flat; RoHS Compliant: Yes; Contact Plating: Tin; Packaging: Tape and Reel; Mount: Surface Mount; Thickness: 0.057inch; Radiation Hardening: No; Dielectric: X7R; Min Operating Temperature: -55°C; Voltage Rating (DC): 10V; Voltage: 10V; Width: 0.049inch; Package Quantity: 1; Number of Pins: 2; Height: 1.25mm; Max Operating Temperature: 125°C; Dielectric Material: Ceramic; Case Code (Imperial): 0805; Lead Free: Lead Free; Voltage Rating: 10V; Case Code (Metric): 2012; Length: 2mm
C66 = CMP-1035-02595-8: Chip Multilayer Ceramic Capacitors for General Purpose, 0603, 0.10uF, X7R, 15%, 10%, 100V; Capacitance: 100nF; Voltage Rating (DC): 100V; Material: Ceramic; Packaging: Tape and Reel; Dielectric: X7R; Case Code (Imperial): 0603; Package Quantity: 1; Height: 0.8mm; Weight: 0.000222oz; Min Operating Temperature: -55°C; Depth: 0.8mm; Mount: Surface Mount; Thickness: 0.035inch; Voltage: 100V; REACH SVHC: No SVHC; Case/Package: 0603; Voltage Rating: 100V; Width: 0.8mm; Tolerance: 10%; Lead Free: Lead Free; Case Code (Metric): 1608; Radiation Hardening: No; Max Operating Temperature: 125°C; Termination: SMD/SMT; Length: 1.6mm
D?#1 D?#2 = MBRS1540T3G: Diode; Manufacturer_Name: onsemi; Datasheet Link: https://www.onsemi.com/pub/Collateral/MBRS1540T3-D.PDF; Height: 2.56mm; Manufacturer_Part_Number: MBRS1540T3G; Mouser Part Number: 863-MBRS1540T3G; Mouser Price/Stock: https://www.mouser.co.uk/ProductDetail/onsemi/MBRS1540T3G?qs=3JMERSakeboNHqMh%252BSYqYg%3D%3D; Arrow Part Number: MBRS1540T3G; Arrow Price/Stock: https://www.arrow.com/en/products/mbrs1540t3g/on-semiconductor?utm_currency=USD&region=europe
IC?#1 = TPS65320QPWPRQ1: Integrated Circuit; Manufacturer_Name: Texas Instruments; Datasheet Link: https://www.ti.com/general/docs/suppproductinfo.tsp?distId=10&gotoUrl=https%3A%2F%2Fwww.ti.com%2Flit%2Fgpn%2Ftps65320-q1; Height: 1.2mm; Manufacturer_Part_Number: TPS65320QPWPRQ1; Mouser Part Number: 595-TPS65320QPWPRQ1; Mouser Price/Stock: https://www.mouser.co.uk/ProductDetail/Texas-Instruments/TPS65320QPWPRQ1?qs=FBI%252BX3tnPf3UK2GiH7QeCQ%3D%3D; Arrow Part Number: TPS65320QPWPRQ1; Arrow Price/Stock: https://www.arrow.com/en/products/tps65320qpwprq1/texas-instruments
J?#2 = CMP-2000-05384-1: Power Jack, 5 A, 3-Pin THD, RoHS, Bulk; Manufacturer: Switchcraft; Current Rating: 5A; Plug/Mating Plug Diameter: 2.1mmID,5.5mmOD; Gender: Male; Mating Products: S765-ND / -CONNPLUGMINIPWR2CONDWHT/RED / S760K-ND / -CONNPOWERPLUGMINI.08"BLACK / SC1052-ND / -CONNPOWERPLUGMINIBLACK; Number of Positions/Contacts: 2Conductors,2Contacts; Internal Switch(s): SingleSwitch,NormallyClosed; Shielding: Unshielded; Catalog Drawings: RAPC7(1,2)2XSide / RAPC7(1,2)2XTop; Dynamic Catalog: SwitchcraftInc; Other Names: Q2287470A / RAPC722X-ND / SC1313; Standard Package: 2,500; Termination: SolderEyelet(s); Family: Barrel-PowerConnectors; Housing Color: Black; Housing Material: Thermoplastic; RoHS Information: SwitchcraftRoHSInfo; Color: Black; Contact Material - Plating: Nickel; Mounting Type: ThroughHole,RightAngle; Manufacturer URL: http://www.switchcraft.com/; Contact Material: Brass; Datasheet Version: Rev. A, 08/2005; Connector Type: Jack; Category: Connectors,Interconnects; Datasheet URL: http://www.mouser.com/ds/2/393/rapc722x_cd-371352.pdf
JP13 = CMP-1024-00332-1: 0.025" SQ Post Header, Through-hole, Vertical, -55 to 105 degC, 2.54 mm Pitch, 3-Pin, Male, RoHS; Manufacturer: Samtec; Pitch: 2.54 mm; ComponentLink1URL: http://www.samtec.com; ComponentLink3URL: http://www.samtec.com/documents/webfiles/cpdf/TSW-XXX-XX-XXX-X-XX-XXX-MKT.pdf; PartNumber: TSW-103-07-T-S; Mounting Technology: Through-hole; RoHS: True; DatasheetVersion: F-214; PackageVersion: DM, 8/1988; Temperature Range: -55 to 105 degC; ComponentLink2Description: Datasheet; ComponentLink1Description: Manufacturer URL; Orientation: Vertical; PackageReference: TSW-103-07-X-S; ComponentLink3Description: Package Specification; ComponentLink2URL: http://www.samtec.com/documents/webfiles/pdf/TSW_TH.PDF; PackageDescription: .025[0.64] SQ. Post Terminal Strip Assembly
L?#3 L?#4 = XFL4020-472MEB: Inductor; Manufacturer_Name: COILCRAFT; Datasheet Link: https://componentsearchengine.com/Datasheets/1/XFL4020-472MEB.pdf; Height: 2.1mm; Manufacturer_Part_Number: XFL4020-472MEB; Mouser Part Number: 994-XFL4020-472MEB; Mouser Price/Stock: https://www.mouser.co.uk/ProductDetail/Coilcraft/XFL4020-472MEB?qs=VJjuEbE9QBPFBMgGchYEoQ%3D%3D
R41 = CRCW25120000Z0EGHP: CRCW2512-HP 0R0 E67 E3; Manufacturer_Name: Vishay; Copyright: Copyright (C) 2025 Ultra Librarian. All rights reserved.; Manufacturer_Part_Number: CRCW25120000Z0EGHP; Datasheet: https://www.vishay.com/doc?20043
R85 = PAT0603E5302BST1: Package: None; Price: None; Value: *; MP: PAT0603E5302BST1; Availability: Unavailable
R86 R88 = CMP-2000-00318-1: Part Number: ERJ-3EKF2002V; Manufacturer: Panasonic
R87 = CMP-2000-00447-1: Part Number: ERJ-3EKF3402V; Manufacturer: Panasonic
R89 = CMP-2000-00413-2: RES SMD 30K OHM 1% 1/10W 0603; Voltage Rating: 75V; Temperature Coefficient: 100ppm/°C; Max Power Dissipation: 100mW; Resistance: 30kR; Case Code (Imperial): 0603; Termination: SMD/SMT; Number of Terminations: 2; Series: ERJ; Features: Automotive AEC-Q200; Width: 0.031inch; Packaging: Tape and Reel; REACH SVHC: No SVHC; Lead Free: Lead Free; RoHS Compliant: Yes; Contact Plating: Tin; Case/Package: 0603; Tolerance: 1%; Mount: Surface Mount; Min Operating Temperature: -55°C; Resistor Type: Thick Film; Radiation Hardening: No; Resistance Tolerance: 1%; Construction: Rectangular; Power Rating: 100mW; Case Code (Metric): 1608; Size Code: 0603; Voltage Rating (DC): 75V; Military Standard: Not; Package Quantity: 1; Depth: 0.8mm; Length: 1.6mm; Height: 0.022inch; Max Operating Temperature: 155°C
R90 = PAT0603E5691BST1: Package: None; Price: None; Value: *; MP: PAT0603E5691BST1; Availability: Unavailable
R91 R92 = CMP-1012-00623-3: Chip Resistor, 10 KOhm, +/- 1%, 0.1 W, -55 to 155 degC, 0603 (1608 Metric), RoHS, Tape and Reel; Manufacturer: Panasonic; Voltage Rating: 75V; Case\/Package: 0603; Power Rating: 100mW; Resistance: 10KOhm; Temperature Coefficient: 100ppm\/degreesC; Number of Pins: 2; Package Reference: 603; Depth: 0.8mm; Mount: SurfaceMount; Package Description: 2-Pin Surface Mount Device, Body 1.6 x 0.85 mm; Datasheet Version: 02/2017; Length: 1.6mm; Lead Free: LeadFree; Height: 0.45mm; Number of Terminations: 2; Max Power Dissipation: 100mW; Min Operating Temperature: -55degC; Datasheet URL: https://industrial.panasonic.com/cdbs/www-data/pdf/RDA0000/AOA0000C304.pdf; Termination: SMD/SMT; Case Code (Metric): 1608; Case Code (Imperial): 0603; Tolerance: 1%; Max Operating Temperature: 155degC; RoHSCompliant: true; Voltage Rating (DC): 75V; Radiation Hardening: No; Packaging: TapeandReel; Composition: ThickFilm; Mounting Technology: SurfaceMount; Manufacturer URL: http://www.panasonic.com/; Width: 0.031inch; REACH SVHC: NoSVHC; Contact Plating: Tin; Military Standard: Not; Package Quantity: 1
R93 R94 = CMP-2000-00700-2: RES SMD 0 OHM JUMPER 1/10W 0603; Manufacturer Part Number: ERJ-3GEY0R00V; Manufacturer: Panasonic; Tolerance: 5%; Automotive Grade: Grade 0; Voltage Rating: 75V; Value: 0Ω; Temperature Coefficient: -100/+600ppm/°C; Power Rating: 0.1W; Mouser Description: Resistor, Chip Thick Film, 0 Ohm, 0.1w, Resistor, Chip Thick Film, 0 Ohm, 0.1w, 5%; Ipc Land Pattern Name: RESC16080X45; Category: Res; Package: 0603; Temperature: -55°C to +155°C; Temperature Range Low: -55°C; Series: ERJ; Resistance: 0Ω; RoHS: TRUE; Composition: Thick Film; Octopart: https://octopart.com/erj-3gey0r00v-panasonic-55389238; Device Class L1: Passive Components; Footprint Url: https://industrial.panasonic.com/cdbs/www-data/pdf/RDA0000/DMA0000COL17.pdf; ComponentLink2Description: Datasheet; Device Class L2: Resistors; Temperature Range High: +155°C; Digikey Description: RES SMD 0 OHM JUMPER 1/10W 0603; Lead Free: Yes; Device Class L3: Chip SMD Resistors; Height: 0.55mm; ComponentLink2URL: https://industrial.panasonic.com/cdbs/www-data/pdf/RDA0000/AOA0000C301.pdf; Automotive: Yes
R96 = CMP-1666-00003-5: RES Thick Film, 1kΩ, 1%, 0.1W, 100ppm/°C, 0603; Max Power Dissipation: 100mW; Voltage Rating: 75V; Resistance: 1kR; Max Operating Temperature: 155°C; Number of Pins: 2; Case Code (Imperial): 0603; Width: 0.033inch; Power Rating: 100mW; Number of Terminations: 2; Package Quantity: 10; Weight: 7.1E-05oz; Tolerance: 1%; Temperature Coefficient: 100ppm/°C; Military Standard: Not; Mount: Surface Mount; Voltage Rating (DC): 75V; Depth: 0.85mm; Composition: Thick Film; Radiation Hardening: No; Termination: SMD/SMT; Length: 1.55mm; Case Code (Metric): 1608; Contact Plating: Tin; Min Operating Temperature: -55°C; Packaging: Tape and Reel; Height: 0.45mm; Lead Free: Lead Free; Case/Package: 0603; Features: Automotive AEC-Q200
TP?#1 TP?#2 = TEST_POINT_RND_1MM: Test Point Round 1mm (NO BOM)

## Sheet DS90UB933TRTVRQ1.SchDoc
size A3; SheetNumber: 5; SheetTotal: 7
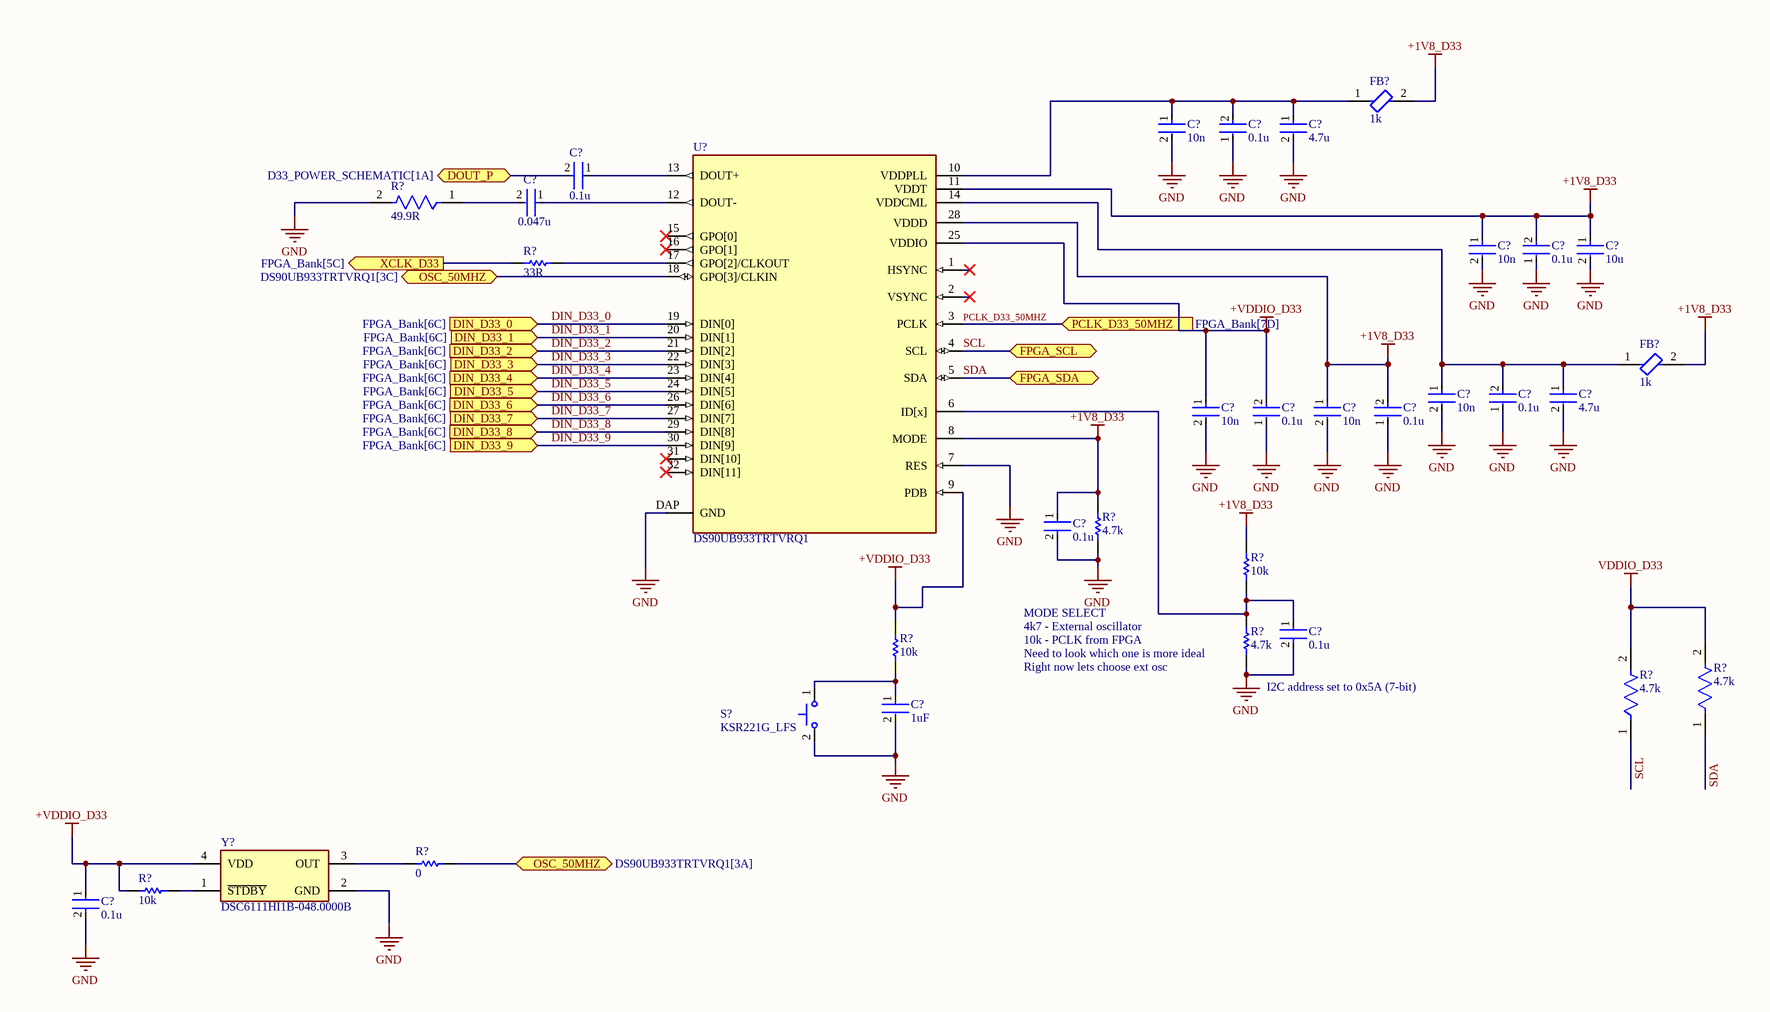
[diagram p2: DS90UB933TRTVRQ1.SchDoc]

### Parts
(Parts that share a designator on the sheet are numbered #1, #2 ... from top to bottom, then left to right.)
C?#23  10n  [FP-GCM155-0_05-IPC_C]
C?#24  0.1u  [FP-GRM15-MFG]
C?#25  4.7u  [FP-GRM188-0_15-IPC_C]
C?#26  0.1u  [FP-GRM15-MFG]
C?#27  0.047u  [FP-C1005-050-0_05-IPC_C]
C?#28  10n  [FP-GCM155-0_05-IPC_C]
C?#29  0.1u  [FP-GRM15-MFG]
C?#30  10u  [FP-GRM188-0_2-MFG]
C?#31  10n  [FP-GCM155-0_05-IPC_C]
C?#32  0.1u  [FP-GRM15-MFG]
C?#33  4.7u  [FP-GRM188-0_15-IPC_C]
C?#34  10n  [FP-GCM155-0_05-IPC_C]
C?#35  0.1u  [FP-GRM15-MFG]
C?#36  10n  [FP-GCM155-0_05-IPC_C]
C?#37  0.1u  [FP-GRM15-MFG]
C?#38  0.1u  [FP-GRM15-MFG]
C?#39  0.1u  [FP-GRM15-MFG]
C?#40  1uF  [FP-C1005-050-0_05-IPC_B]
C?#41  0.1u  [FP-GRM15-MFG]
FB?#3  1k  [FP-BLM15-0_05-IPC_C]
FB?#4  1k  [FP-BLM15-0_05-IPC_C]
R?#29  49.9R  [FP-CRCW0402-e3-MFG]
R?#30  33R  [RESC1005X40X25ML05T05]
R?#31  4.7k  [RESC1005X40X25LL05T05]
R?#32  10k  [RESC1005X40X25ML05T10]
R?#33  4.7k  [RESC1005X40X25LL05T05]
R?#34  10k  [RESC1005X40X25ML05T10]
R?#35  4.7k  [FP-CRCW0402-e3-IPC_A]
R?#36  4.7k  [FP-CRCW0402-e3-IPC_A]
R?#37  0  [RESC1005X40X25LL05T05]
R?#38  10k  [RESC1005X40X25ML05T10]
S?#4  KSR221G_LFS  [KSR]
U?#2  DS90UB933TRTVRQ1  [FP-RTV0032A-IPC_A]
Y?  DSC6111HI1B-048.0000B  [DSC6111HI1B0480000B]

### Ports
DIN_D33_0 (in, see FPGA_Bank[6C]), DIN_D33_1 (in, see FPGA_Bank[6C]), DIN_D33_2 (in, see FPGA_Bank[6C]), DIN_D33_3 (in, see FPGA_Bank[6C]), DIN_D33_4 (in, see FPGA_Bank[6C]), DIN_D33_5 (in, see FPGA_Bank[6C]), DIN_D33_6 (in, see FPGA_Bank[6C]), DIN_D33_7 (in, see FPGA_Bank[6C]), DIN_D33_8 (in, see FPGA_Bank[6C]), DIN_D33_9 (in, see FPGA_Bank[6C]), DOUT_P (bidir, see D33_POWER_SCHEMATIC[1A]), FPGA_SCL (bidir, see FPGA_Bank[5A], Serializer_DS90UB913A[6C]), FPGA_SDA (bidir, see FPGA_Bank[5A], Serializer_DS90UB913A[6C]), OSC_50MHZ (bidir, see DS90UB933TRTVRQ1[3A]), OSC_50MHZ (bidir, see DS90UB933TRTVRQ1[3C]), PCLK_D33_50MHZ (in, see FPGA_Bank[7D]), XCLK_D33 (out, see FPGA_Bank[5C])

### Nets
+1V8_D33: C?#28.1 C?#29.2 C?#30.1 C?#36.1 C?#37.2 C?#38.1 FB?#3.2 FB?#4.2 R?#31.2 R?#32.2 U?#2.8(MODE) U?#2.11(VDDT) U?#2.28(VDDD)
+VDDIO_D33: C?#34.1 C?#35.2 C?#41.1 R?#34.2 R?#38.2 U?#2.9(PDB) U?#2.25(VDDIO) Y?.4(VDD)
GND: C?#23.2 C?#24.1 C?#25.2 C?#28.2 C?#29.1 C?#30.2 C?#31.2 C?#32.1 C?#33.2 C?#34.2 C?#35.1 C?#36.2 C?#37.1 C?#38.2 C?#39.2 C?#40.2 C?#41.2 R?#29.2 R?#31.1 R?#33.1 S?#4.2 U?#2.7(RES) U?#2.DAP(GND) Y?.2(GND)
VDDIO_D33: R?#35.2 R?#36.2
DIN_D33_0: U?#2.19(DIN[0]) ; port DIN_D33_0
DIN_D33_1: U?#2.20(DIN[1]) ; port DIN_D33_1
DIN_D33_2: U?#2.21(DIN[2]) ; port DIN_D33_2
DIN_D33_3: U?#2.22(DIN[3]) ; port DIN_D33_3
DIN_D33_4: U?#2.23(DIN[4]) ; port DIN_D33_4
DIN_D33_5: U?#2.24(DIN[5]) ; port DIN_D33_5
DIN_D33_6: U?#2.26(DIN[6]) ; port DIN_D33_6
DIN_D33_7: U?#2.27(DIN[7]) ; port DIN_D33_7
DIN_D33_8: U?#2.29(DIN[8]) ; port DIN_D33_8
DIN_D33_9: U?#2.30(DIN[9]) ; port DIN_D33_9
PCLK_D33_50MHZ: U?#2.3(PCLK) ; port PCLK_D33_50MHZ
SCL: R?#36.1 U?#2.4(SCL) ; port FPGA_SCL
SDA: R?#35.1 U?#2.5(SDA) ; port FPGA_SDA
NetC?#23_1: C?#23.1 C?#24.2 C?#25.1 FB?#3.1 U?#2.10(VDDPLL)
NetC?#26_1: C?#26.1 U?#2.13(DOUT+)
NetC?#26_2: C?#26.2 ; port DOUT_P
NetC?#27_1: C?#27.1 U?#2.12(DOUT-)
NetC?#27_2: C?#27.2 R?#29.1
NetC?#31_1: C?#31.1 C?#32.2 C?#33.1 FB?#4.1 U?#2.14(VDDCML)
NetC?#39_1: C?#39.1 R?#32.1 R?#33.2 U?#2.6(ID[x])
NetC?#40_1: C?#40.1 R?#34.1 S?#4.1
NetIC?#5_B1: R?#30.1 ; port XCLK_D33
NetR?#30_2: R?#30.2 U?#2.17(GPO[2]/CLKOUT)
NetR?#37_1: R?#37.1 Y?.3(OUT)
NetR?#37_2: R?#37.2 U?#2.18(GPO[3]/CLKIN) ; port OSC_50MHZ
NetR?#38_1: R?#38.1 Y?.1(~{STDBY})

Not connected (* = marked no-connect by the designer): U?#2 1(HSYNC)* 2(VSYNC)* 15(GPO[0])* 16(GPO[1])* 31(DIN[10])* 32(DIN[11])*

### Notes on the sheet
- MODE SELECT
- `
- 4k7 - External oscillator
- 10k - PCLK from FPGA
- (near R?#33) Need to look which one is more ideal
- (near R?#33) Right now lets choose ext osc
- I2C address set to 0x5A (7-bit)

### Library data of the parts
C?#23 C?#28 C?#31 C?#34 C?#36 = CMP-2008-03723-3: Ceramic Capacitor for Automotive 10nF ±10% 50VDC X7R 0402 Paper T/R; Voltage Rating (DC): 50V; Min Operating Temperature: -55°C; Radiation Hardening: No; Mount: Surface Mount; Thickness: 0.022inch; Package Quantity: 1; Case Code (Imperial): 0402; Lead Free: Lead Free; Case/Package: 0402; Depth: 0.5mm; Termination: SMD/SMT; Tolerance: 10%; Voltage: 50V; Packaging: Tape and Reel; Width: 0.02inch; REACH SVHC: No SVHC; Height: 0.5mm; Max Operating Temperature: 125°C; Case Code (Metric): 1005; Voltage Rating: 50V; Capacitance: 10nF; Ratings: AEC-Q200; Length: 1mm; Dielectric: X7R
C?#24 C?#26 C?#29 C?#32 C?#35 C?#37-C?#39 C?#41 = CMP-2100-03641-2: as C?#1 on sheet Serializer_DS90UB913A; RoHS: TRUE; Temperature Characteristic: X7R; Octopart: https://octopart.com/grm155r71c104ka88d-murata-196880; Digikey Description: CAP CER 0.1UF 16V X7R 0402; Device Class L3: Ceramic Capacitors; Height: 0.55mm; ComponentLink2Description: Datasheet; Temperature Range Low: -55°C; Ipc Land Pattern Name: CAPC10050X219; ComponentLink2URL: https://search.murata.co.jp/Ceramy/image/img/A01X/G101/ENG/GRM155R71H471KA01-01A.pdf; Device Class L1: Passive Components; Lead Free: yes; Category: Cap; Package: GRM15; Temperature: -55°C to +125°C; Device Class L2: Capacitors; Temperature Range High: +125°C; Mouser Description: 0402 0.1 uF 16V ±10 % Tolerance X7R SMT Multilayer Ceramic Capacitor
C?#25 C?#33 = CMP-2006-02523-2: Chip Multilayer Ceramic Capacitors for General Purpose, 0603, 4.7uF, X5R, 15%, 10%, 25V; Case Code (Metric): 1608; Max Operating Temperature: 85°C; REACH SVHC: No SVHC; Voltage Rating: 25V; Dielectric: X5R; Packaging: Cut Tape; Width: 0.031inch; Min Operating Temperature: -55°C; Lead Free: Lead Free; Capacitance: 4.7uF; Height: 0.8mm; Case Code (Imperial): 0603; Length: 1.6mm; Voltage Rating (DC): 25V; Case/Package: 0603; Voltage: 25V; Tolerance: 10%; Thickness: 0.031inch; Mount: Surface Mount; Material: Ceramic; Package Quantity: 4000; Depth: 0.8mm
C?#27 = CMP-2000-06006-2: Multilayer Ceramic Capacitors 47nF ±10% 50V X7R SMD 0402; Dissipation Factor: 5%; Weight: 2.3E-05oz; Max Operating Temperature: 125°C; Package Quantity: 1; Width: 0.02inch; Min Operating Temperature: -55°C; Length: 1mm; Dielectric: X7R; Voltage Rating: 50V; Number of Pins: 2; Lead Free: Lead Free; Voltage: 50V; Dielectric Material: Ceramic; Height: 0.5mm; Case Code (Metric): 1005; Capacitance: 47nF; Voltage Rating (DC): 50V; Construction: Flat; Termination: SMD/SMT; Case Code (Imperial): 0402; Depth: 0.5mm; Packaging: Tape and Reel; Mount: Surface Mount; Series: C; RoHS Compliant: Yes; Tolerance: 10%; Case/Package: 0402; Thickness: 0.022inch; Radiation Hardening: No; Resistor Type: Ceramic; REACH SVHC: No SVHC
C?#30 = CMP-2006-02520-2: Chip Multilayer Ceramic Capacitors for General Purpose, 0603, 10uF, X5R, 15%, 20%, 25V; Tolerance: 20%; Resistor Type: Ceramic; Voltage: 25V; Max Operating Temperature: 85°C; Min Operating Temperature: -55°C; Capacitance: 10uF; Dielectric: X5R; Lead Free: Lead Free; REACH SVHC: No SVHC; Case/Package: 0603; Mount: Surface Mount; Voltage Rating (DC): 25V; Height: 0.8mm; Length: 1.6mm; Thickness: 0.031inch; Width: 0.031inch; Termination: SMD/SMT; Case Code (Imperial): 0603; Case Code (Metric): 1608; Package Quantity: 1; Packaging: Tape and Reel; Depth: 0.8mm; Voltage Rating: 25V; Weight: 0.000222oz; Number of Pins: 2
C?#40 = CMP-2000-06001-2: Multilayer Ceramic Capacitors 1μF ±10% 25V X5R SMD 0402; Package Quantity: 1; Radiation Hardening: No; Dielectric: X5R; REACH SVHC: No SVHC; RoHS Compliant: Yes; Case Code (Imperial): 0402; Voltage Rating: 25V; Termination: SMD/SMT; Max Operating Temperature: 85°C; Capacitance: 1uF; Series: C; Packaging: Tape and Reel; Tolerance: 10%; Voltage Rating (DC): 25V; Weight: 2.3E-05oz; Height: 0.5mm; Resistor Type: Ceramic; Thickness: 0.022inch; Min Operating Temperature: -55°C; Length: 1mm; Lead Free: Lead Free; Depth: 0.5mm; Dielectric Material: Ceramic; Width: 0.02inch; Case/Package: 0402; Case Code (Metric): 1005; Mount: Surface Mount
FB?#3 FB?#4 = CMP-0686-00279-4: Chip Ferrite Bead, 0402, 1000Ω @ 100MHz, 1.25Ω, 25%, 250mA; Manufacturer Series: BLM15H; Number of Functions: 1; DC Resistance-Max: 1.25R; Impedance: 1kR; Shielding: Unshielded; Material: Steel; Series: BLM15H; Case Code (Metric): 1005; Contact Plating: Tin; Width: 0.5mm; Current Rating: 250mA; Number of Circuits: 1; Min Operating Temperature: -55°C; Number of Pins: 2; Core Material: Ferrite; Packaging: Tape and Reel; DC Resistance (DCR): 1.25R; Height: 0.5mm; REACH SVHC: No SVHC; Max Current Rating: 250mA; Depth: 0.5mm; Tolerance: 25%; Termination: SMD/SMT; RoHS Compliant: Yes; Package Quantity: 1; Number of Lines: 1; Max DC Current: 250mA; Radiation Hardening: No; Resistance: 1.25R; Lead Free: Lead Free; DC Current: 250mA; Length: 1mm; Test Frequency: 100MHz; Frequency: 100MHz; Case Code (Imperial): 0402; Max Operating Temperature: 125°C; Case/Package: 0402; Military Standard: Not
R?#29 = CMP-1011-00363-3: RES Thick Film, 49.9Ω, 1%, 0.063W, 100ppm/°C, 0402; Voltage Rating: 50V; Power Rating: 63mW; Temperature Coefficient: 100ppm/°C; Resistance: 49.9R; Packaging: Tape and Reel; Height: 0.35mm; Length: 1mm; Case Code (Metric): 1005; Weight: 2.3E-05oz; Case Code (Imperial): 0402; Voltage Rating (DC): 50V; Composition: Thick Film; Lead Free: Lead Free; Package Quantity: 10; Number of Terminations: 2; Width: 0.5mm; Max Operating Temperature: 155°C; Depth: 0.5mm; Max Power Dissipation: 63mW; Tolerance: 1%; Radiation Hardening: No; Features: Automotive AEC-Q200; Min Operating Temperature: -55°C; Contact Plating: Tin; Mount: Surface Mount; Military Standard: Not; Termination: SMD/SMT; Case/Package: 0402
R?#30 = CMP-2002-08531-1: Manufacturer: Vishay Dale; Part Number: CRCW040233R0JNED
R?#31 R?#33 = CMP-2002-01154-4: as R?#27 on sheet Serializer_DS90UB913A; Height: 0.35 mm; Mounting Technology: Surface Mount; REACH SVHC: Yes; Resistance: 4.7 KOhm; Max Operating Temperature: 155 degC; ComponentLink1Description: Manufacturer URL; ComponentLink2Description: Datasheet; Pins: 2; PackageReference: 0402; Tolerance: 1%; Case Code (Imperial): 0402; Length: 1 mm; PackageDescription: 2-Pin Surface Mount Device, Body 1 x 0.5 mm; RoHSCompliant: true; Package Quantity: 1; Radiation Hardening: No; DatasheetVersion: 04/2015; Width: 0.5 mm; Case Code (Metric): 1005; Mount: Surface Mount; ComponentLink1URL: http://www.panasonic.com/; Min Operating Temperature: -55 degC; Packaging: Cut Tape; ComponentLink2URL: http://industrial.panasonic.com/cdbs/www-data/pdf/RDA0000/AOA0000C86.pdf
R?#32 R?#34 R?#38 = CMP-2002-03043-1: Part Number: CRCW040210K0FKEDHP; Manufacturer: Vishay Dale
R?#35 R?#36 = CMP-2002-00052-3: RES Thick Film, 4.7kΩ, 5%, 0.063W, 200ppm/°C, 0402; Power Rating: 63mW; Resistance: 4.7kR; Voltage Rating: 50V; Case Code (Metric): 1005; Case/Package: 0402; Composition: Thick Film; Depth: 0.5mm; Min Operating Temperature: -55°C; Temperature Coefficient: 200ppm/°C; Max Power Dissipation: 63mW; Packaging: Tape and Reel; Max Operating Temperature: 155°C; Number of Terminations: 2; Width: 0.5mm; Height: 0.35mm; Contact Plating: Tin; Package Quantity: 1; Length: 1mm; Termination: SMD/SMT; Radiation Hardening: No; Weight: 2.3E-05oz; Military Standard: Not; Case Code (Imperial): 0402; Features: Automotive AEC-Q200; Tolerance: 5%
R?#37 = CMP-2000-07451-1: as R?#15 on sheet Serializer_DS90UB913A; Number of Terminations: 2; Mount: SurfaceMount; Height: 0.35mm; Packaging: TapeandReel; Contact Plating: Tin; Manufacturer URL: http://www.panasonic.com/; Composition: ThickFilm; Max Operating Temperature: 155degC; REACH SVHC: NoSVHC; Case/Package: 0402; Package Reference: 402; Depth: 0.5mm; Package Description: 2-Pin Surface Mount Device, Body 1 x 0.5 mm; Datasheet URL: https://industrial.panasonic.com/cdbs/www-data/pdf/RDA0000/AOA0000C301.pdf; RoHSCompliant: True; Case Code (Imperial): 0402; Military Standard: Not; Min Operating Temperature: -55degC; Power Rating: 100mW; Datasheet Version: 03/2015; Length: 1mm; Case Code (Metric): 1005; Termination: SMD/SMT; Mounting Technology: SurfaceMount; Voltage Rating: 50V; Width: 0.02inch; Package Quantity: 1; Lead Free: LeadFree; Radiation Hardening: No
S?#4 = KSR221G_LFS: Switch; Manufacturer_Name: C & K COMPONENTS; Manufacturer_Part_Number: KSR221G LFS; Datasheet Link: http://www.ckswitches.com/media/1466/ksr.pdf; Mouser Part Number: 611-KSR221G-LFS; Mouser Price/Stock: https://www.mouser.co.uk/ProductDetail/CK/KSR221G-LFS?qs=nrpkpS80q8EnsbmSijdd7Q%3D%3D; Arrow Part Number: KSR221G LFS; Arrow Price/Stock: https://www.arrow.com/en/products/ksr221glfs/ck?utm_currency=USD&region=europe
U?#2 = CMP-04882-000010-1: IC SERIALIZER FPD-LINK 32WQFN; Number of Inputs: 12; Number of Outputs: 2; RoHS Compliant: Yes; Min Operating Temperature: -40°C; Mount: Surface Mount; Packaging: Tape and Reel; Max Operating Temperature: 105°C
Y? = DSC6111HI1B-048.0000B: Crystal or Oscillator; Manufacturer_Name: Microchip; Datasheet Link: https://ww1.microchip.com/downloads/aemDocuments/documents/TCG/ProductDocuments/DataSheets/DSC61xxB-Ultra-Small-Ultra-Low-Power-MEMS-Oscillator-DS20006155.pdf; Height: 0.89mm; Manufacturer_Part_Number: DSC6111HI1B-048.0000B